# EAGLE design iridia-tam-right-board (EAGLE 6.1)
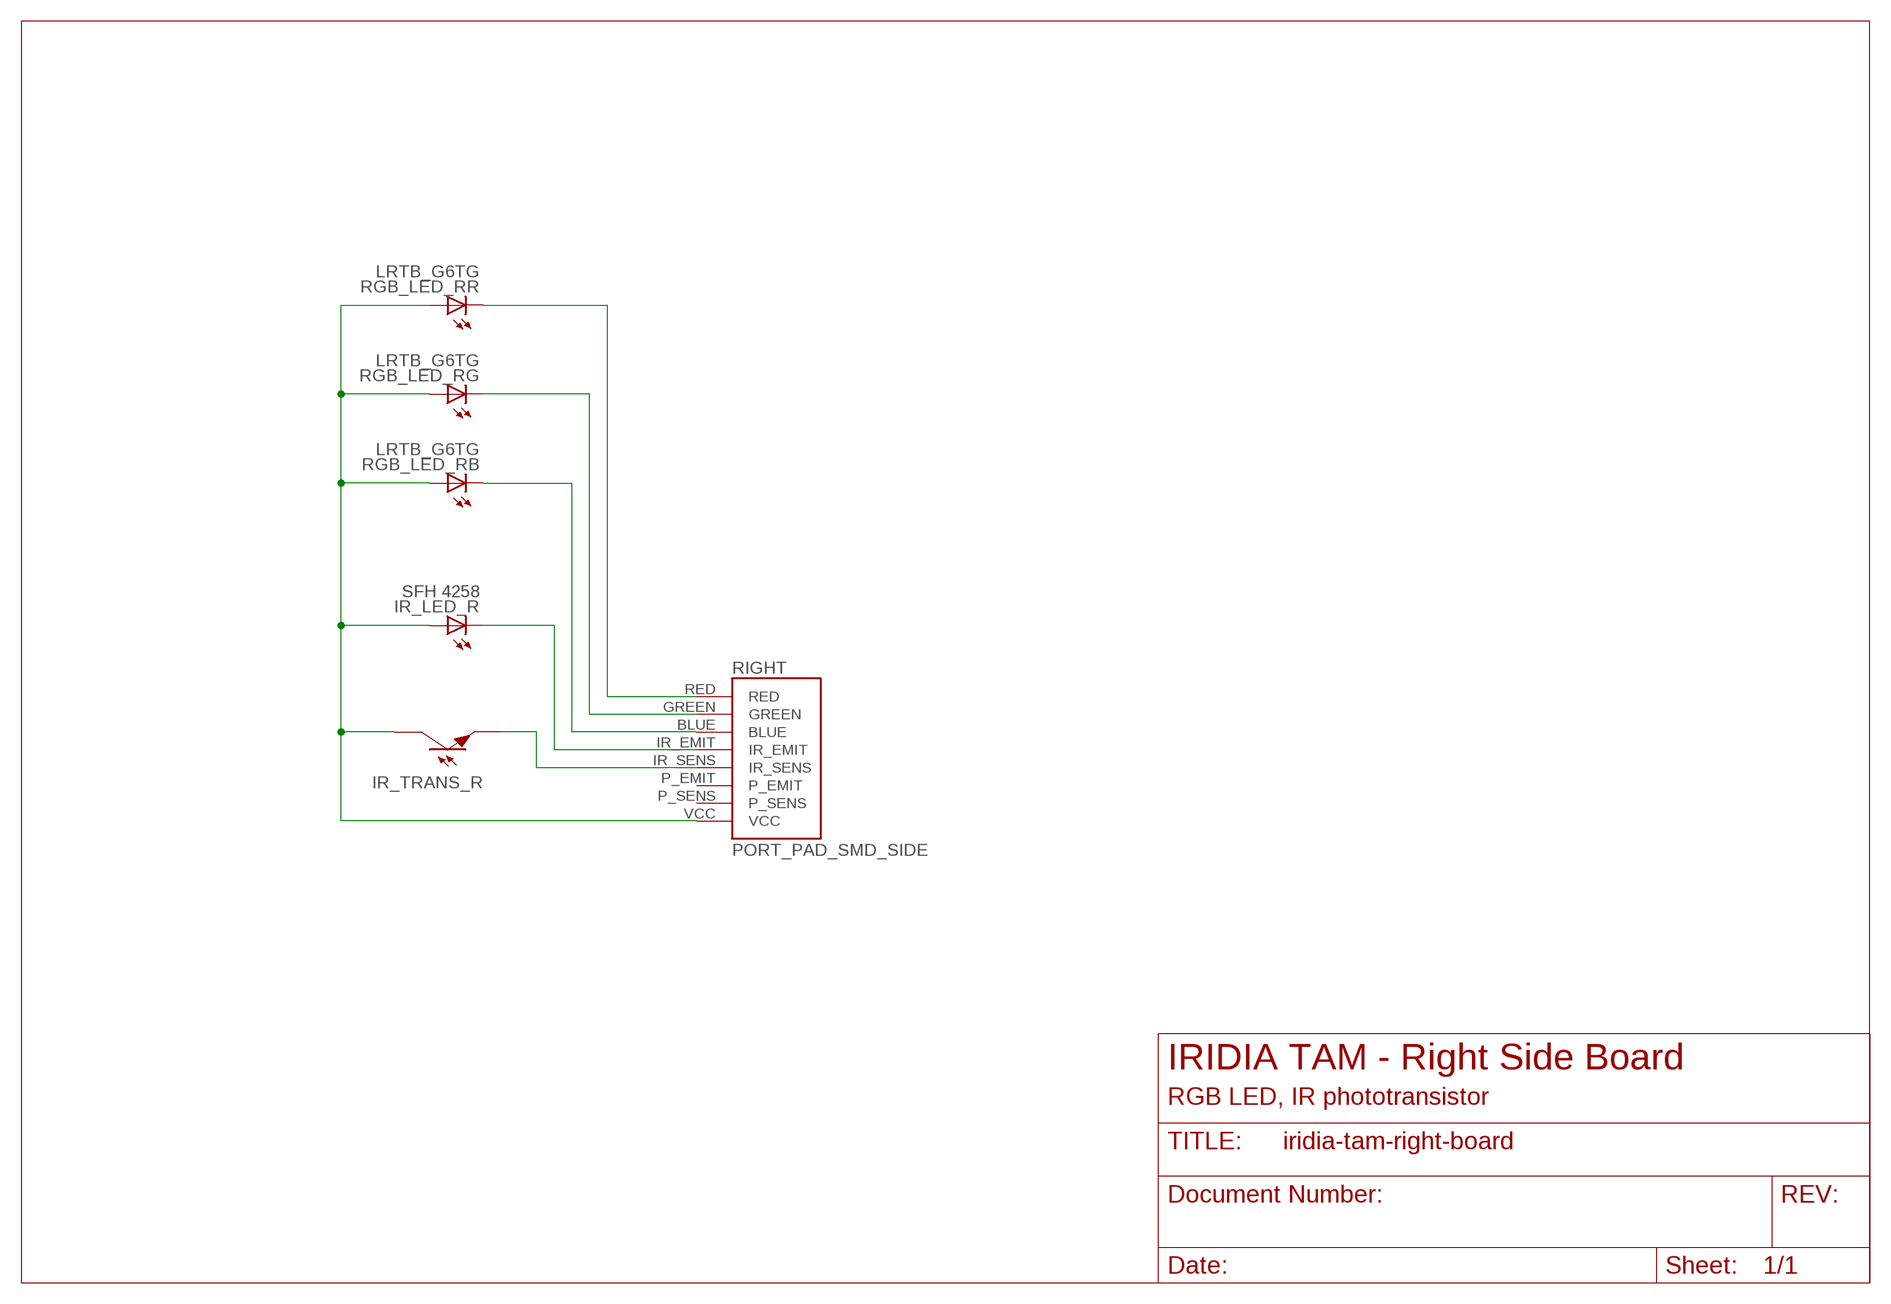
[diagram p0: schematic, sheet 1]

## Parts
IR_LED_R  SFH 4258  LEDP-LCC-4  [P-LCC-4-1C-3A]
IR_TRANS_R  SFH 320 FA  IR_TRANSP-LCC-2  [P-LCC-2-TRANS]
RGB_LED_R  LRTB_G6TG  MULTILED_LRTB_G6TG  [P-LCC-6_TOPLED]
RIGHT  PORT_PAD_SMD_SIDE  [PORT_PAD_SMD_SIDE]

## Nets
BLUE_R: RGB_LED_R.C3(B:C) RIGHT.BLUE
GREEN_R: RGB_LED_R.C2(G:C) RIGHT.GREEN
IR_EMIT_R: IR_LED_R.C@1(C) RIGHT.IR_EMIT
IR_SENSE_R: IR_TRANS_R.E RIGHT.IR_SENS
RED_R: RGB_LED_R.C1(R:C) RIGHT.RED
VCC [power]: IR_LED_R.A@2(A) IR_LED_R.A@3(A) IR_LED_R.A@4(A) IR_TRANS_R.COL RGB_LED_R.A1(R:A) RGB_LED_R.A2(G:A) RGB_LED_R.A3(B:A) RIGHT.VCC
Unconnected: RIGHT.P_EMIT RIGHT.P_SENS

## Notes on the sheet
- IRIDIA TAM - Right Side Board
- RGB LED, IR phototransistor

## Library data of the parts
IR_LED_R = iridia:LED: LED OSRAM: - CHIPLED LG R971, LG N971, LY N971, LG Q971, LY Q971, LO R971, LY R971 LH N974, LH R974 LS Q976, LO Q976, LY Q976 LO Q996 - Hyper CHIPLED LW Q18S LB Q993, LB Q99A, LB R99A - SideLED LS A670, LO A670, LY A670, LG A670, LP A670 LB A673, LV A673, LT A673, LW A673 LH A674 LY A675 LS A676, LA A676, LO A676, LY A676, LW A676 LS A679, LY A679, LG A679 - Hyper Micro SIDELED® LS Y876, LA Y876, LO Y876, LY Y876 LT Y87S - SmartLED LW L88C, LW L88S LB L89C, LB L89S, LG L890 LS L89K, LO L89K, LY L89K LS L896, LA L896, LO L896, LY L896 - TOPLED LS T670, LO T670, LY T670, LG T670, LP T670 LSG T670, LSP T670, LSY T670, LOP T670, LYG T670 LG T671, LOG T671, LSG T671 LB T673, LV T673, LT T673, LW T673 LH T674 LS T676, LA T676, LO T676, LY T676, LB T676, LH T676, LSB T676, LW T676 LB T67C, LV T67C, LT T67C, LS T67K, LO T67K, LY T67K, LW E67C LS E67B, LA E67B, LO E67B, LY E67B, LB E67C, LV E67C, LT E67C LW T67C LS T679, LY T679, LG T679 LS T770, LO T770, LY T770, LG T770, LP T770 LB T773, LV T773, LT T773, LW T773 LH T774 LS E675, LA E675, LY E675, LS T675 LS T776, LA T776, LO T776, LY T776, LB T776 LHGB T686 LT T68C, LB T68C - Hyper Mini TOPLED® LB M676 - Mini TOPLED Santana® LG M470 LS M47K, LO M47K, LY M47K Source: http://www.osram.convergy.de LUXEON: - LUMILED® LXK2-PW12-R00, LXK2-PW12-S00, LXK2-PW14-U00, LXK2-PW14-V00 LXK2-PM12-R00, LXK2-PM12-S00, LXK2-PM14-U00 LXK2-PE12-Q00, LXK2-PE12-R00, LXK2-PE12-S00, LXK2-PE14-T00, LXK2-PE14-U00 LXK2-PB12-K00, LXK2-PB12-L00, LXK2-PB12-M00, LXK2-PB14-N00, LXK2-PB14-P00, LXK2-PB14-Q00 LXK2-PR12-L00, LXK2-PR12-M00, LXK2-PR14-Q00, LXK2-PR14-R00 LXK2-PD12-Q00, LXK2-PD12-R00, LXK2-PD12-S00 LXK2-PH12-R00, LXK2-PH12-S00 LXK2-PL12-P00, LXK2-PL12-Q00, LXK2-PL12-R00 Source: www.luxeon.com KINGBRIGHT: KA-3528ASYC Source: www.kingbright.com
IR_TRANS_R = iridia:IR_TRANS: IR TRANSITOR Package P-LCC-2 Osram SFH 320, SFH 320 FA
RGB_LED_R = led:MULTILED_LRTB_G6TG: 6-lead MULTILED® Enhanced optical Power LED (ThinFilm® / ThinGaN®) Source. OSRAM - LRTB_G6TG.pdf
RIGHT = iridia:PORT_PAD_SMD_SIDE: Connector pad for soldering side boards on side board of IRIDIA TAM

## Net classes
0 default: width 0.254 mm, drill 0.305 mm, clearance 0.152 mm
1 power: width 0.61 mm, drill 0.508 mm, clearance 0.152 mm
2 gnd: width 0.305 mm, drill 0.508 mm, clearance 0.152 mm
3 usbvcc: width 0.508 mm, drill 0.508 mm, clearance 0.152 mm
4 aref: width 0.406 mm

## Board
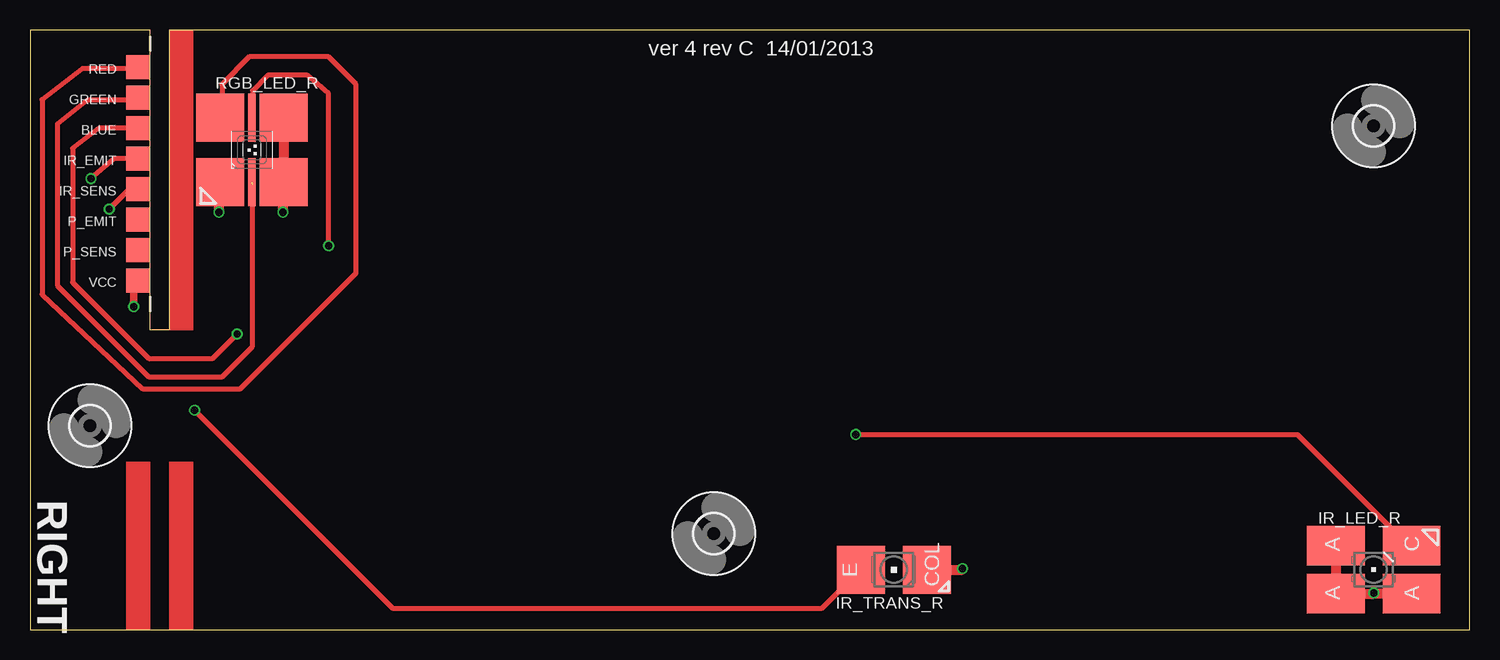
[diagram p1: board, top side]
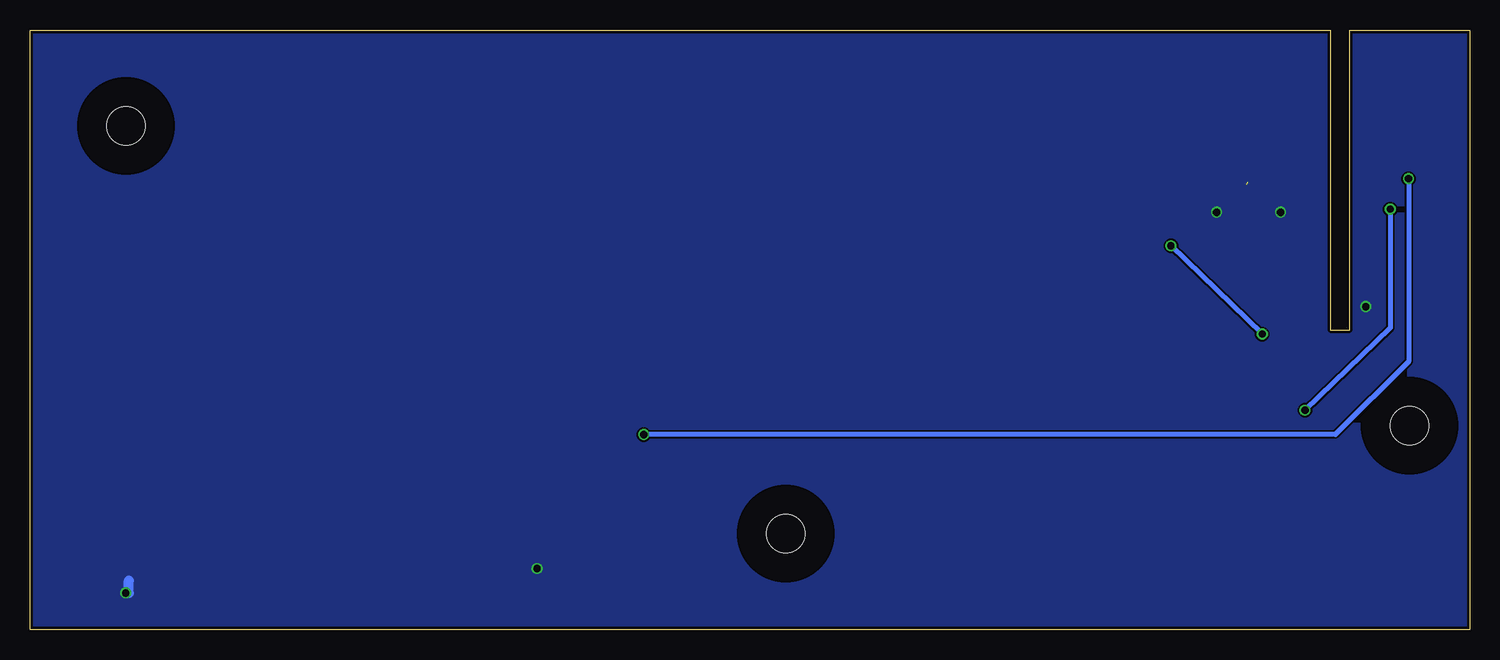
[diagram p2: board, bottom side, seen from below]

Size 120 x 50 mm. Coordinates in mm from the lower left corner, seen from the top.
Outline: 0,0 120,0 120,50 11.6,50 11.6,25 10,25 10,50 0,50 0,0
Copper layers (1*16): Top 0.035mm / dielectric 1.5mm / Bottom 0.035mm
Design rules "default": minimum track width 6mil, minimum drill 12mil, track to track 6mil, track to pad 6mil, pad to pad 6mil, via to via 6mil, smd to smd 0mil, copper to edge 10mil, drill to drill 10mil, minimum pad ring 10mil, minimum via ring 6mil, stop-mask expansion 2mil, vias tented up to drill 100mil, thermal gap 10mil

### Footprints (pad centres in the part's own frame; a part is rotated, then mirrored left to right if it is on the bottom)
P-LCC-4-1C-3A = smd 3.3 x 4.8: A@2 -2,-3.15; A@3 -2,3.15; A@4 2,3.15; C@1 2,-3.15
P-LCC-2-TRANS = smd 4 x 4: COL 0,-2.75; E 0,2.75
P-LCC-6_TOPLED = smd 4 x 4: A1 -2.65,-2.7; A2 2.65,-2.7; A3 2.65,2.7; C1 -2.65,2.7 | smd 0.6 x 4: C2 0,-2.7; C3 0,2.7
PORT_PAD_SMD_SIDE = smd 2 x 2: BLUE 0,-3.81; GREEN 0,-6.35; IR_EMIT 0,-1.27; IR_SENS 0,1.27; P_EMIT 0,3.81; P_SENS 0,6.35; RED 0,-8.89; VCC 0,8.89
3,2 = hole 3.2: 0,0

### Placement (x,y rotation side)
IR_LED_R  112,5 90 top
IR_TRANS_R  72,5 90 top
RGB_LED_R  18.5,40 0 top
RIGHT  9,38 180 top
U$1  [3,2]  5,17 0 top
U$2  [3,2]  112,42 0 top
U$3  [3,2]  57,8 0 top

### Tracks (layer width: path | path; a pad name or v marks a point on that pad's centre or on a via)
BLUE_R  (via drill 0.6)
  Top 0.406: RIGHT.BLUE 5.74,41.81 3.56,40.13 3.56,28.96 9.91,22.61 15.24,22.61 v17.27,24.64 | v24.89,32 24.89,44.7 23.11,46.23 19.81,46.23 18.54,44.96 18.54,42.74 RGB_LED_R.C3
  Bottom 0.406: v17.27,24.64 v24.89,32
GREEN_R  (1 unrouted)
  Top 0.254: 8.53,44.23 9.04,44.15 9,44.4 RIGHT.GREEN
  Top 0.406: 9.04,44.15 4.78,44.15 2.29,42.16 2.29,28.7 9.91,21.08 16,21.08 18.54,23.62 18.54,37.08
IR_EMIT_R  (via drill 0.6)
  Top 0.406: RIGHT.IR_EMIT 7.01,39.27 v5.08,37.59 | v68.83,16.26 105.66,16.26 115.06,6.86 115.15,6.95 IR_LED_R.C@1
  Bottom 0.406: v5.08,37.59 5.08,22.35 11.18,16.26 v68.83,16.26
IR_SENSE_R  (via drill 0.6)
  Top 0.406: RIGHT.IR_SENS 8.28,36.73 v6.6,35.05 | v13.72,18.29 30.23,1.78 66.03,1.78 IR_TRANS_R.E
  Bottom 0.406: v6.6,35.05 6.6,25.15 v13.72,18.29
RED_R
  Top 0.254: 8.98,46.76 RIGHT.RED
  Top 0.406: 8.98,46.76 4.32,46.76 4.32,46.74 1.02,44.2 1.02,27.94 9.4,20.07 17.53,20.07 27.18,29.72 27.18,45.47 24.89,47.75 18.29,47.75 16,45.47 16,42.85 RGB_LED_R.C1
VCC  (via drill 0.6)
  Top 0.61: RIGHT.VCC 8.61,29.24 v8.64,26.92
  Top 0.813: IR_TRANS_R.COL 77.72,5 v77.72,5.08 | IR_LED_R.A@4 IR_LED_R.A@3 112.01,3 | 115.32,3.05 115.06,3.05 115.06,3 IR_LED_R.A@2 112.01,3 | 112.01,3 v112.01,3.05 | RGB_LED_R.A3 RGB_LED_R.A2 21.08,37.3 v21.08,34.8 | RGB_LED_R.A1 15.75,37.3 v15.75,34.8
  Bottom 0.813: v112.01,3.05 111.76,3.05 111.76,4.06
  pour Bottom: 0,50 120,50 120,0 0,0
(copper drawn outside any net)
  shapes: Top area x3

### Text on the board
tPlace: ver 4 rev C 14/01/2013